# Altium schematic sheet CAN v1.SchDoc
size 297 x 209 mm
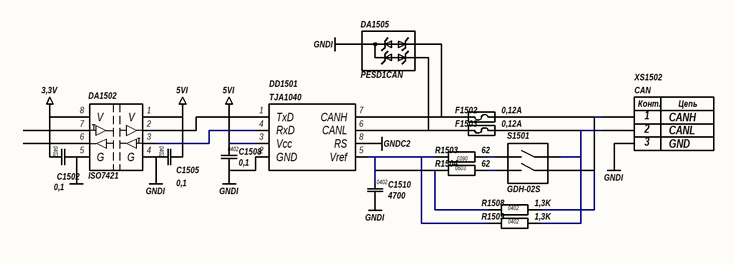
[diagram p0: CAN v1.SchDoc]

## Parts
C1502  0,1  [CAP0402]
C1505  0,1  [CAP0402]
C1508  0,1  [CAP0402]
C1510  4700  [CAP0402]
DA1502  ISO7421  [SO8]
DA1505  PESD1CAN  [SOT-23]
DD1501  TJA1040  [SO8]
F1502  0,12A  [MF-NSMF]
F1503  0,12A  [MF-NSMF]
R1503  62  [RES0603]
R1504  62  [RES0603]
R1508  1,3K  [RES0402]
R1509  1,3K  [RES0402]
S1501  GDH-02S  [GDH02S]
XS1502  CAN  [MW-3M]

## Nets
3,3V: C1502.1 DA1502.8(V)
5VI: C1505.2 C1508.1 DA1502.1(V) DD1501.3(Vcc)
GND: C1502.2 DA1502.5(G)
GNDC2: DD1501.8(RS)
GNDI: C1505.1 C1508.2 C1510.2 DA1502.4(G) DA1505.3(K3) DD1501.2(GND) XS1502.3(GND)
NetC1510_1: C1510.1 DD1501.5(Vref) R1503.2 R1504.1 R1508.1 R1509.1
NetDA1502_2: DA1502.2 DD1501.1(TxD)
NetDA1502_3: DA1502.3 DD1501.4(RxD)
NetDA1505_1: DA1505.1(K1) DD1501.7(CANH) F1502.1
NetDA1505_2: DA1505.2(K2) DD1501.6(CANL) F1503.1
NetF1502_2: F1502.2 R1508.2 S1501.2(2-3) XS1502.1(CANH)
NetF1503_2: F1503.2 R1509.2 S1501.1(1-4) XS1502.2(CANL)
NetR1503_1: R1503.1 S1501.4(4-1)
NetR1504_2: R1504.2 S1501.3(3-2)

Not connected (* = marked no-connect by the designer): DA1502 6 7

## Notes on the sheet
- (in symbol Разъем3_1) Конт.; Цепь

## Library data of the parts
C1502 = CAP_0402: Конденсатор чип; Напряжение: 16V; Тип корпуса: 0402; Тип монтажа: Поверхностный; Номинал: 0,1; Тип компонента: Конденсатор чип; Value: 0,1
C1505 C1508 C1510 = CAP_0402: Конденсатор чип; Тип корпуса: 0402; Тип монтажа: Поверхностный; Тип компонента: Конденсатор чип
  C1505 C1508: Value: 0,1; Номинал: 0,1
  C1510: Номинал: 4700; Value: 4700
DA1502 = ISO7421: Цифровой изолятор 1 вх 1 вых; Тип монтажа: Поверхностный; Производитель: Texas Instruments; Наименование: ISO7421; Тип компонента: Цифровой изолятор 1 вх 1 вых; Тип корпуса: SO8
DA1505 = PESD1CAN: ESD-CAN защита; Тип корпуса: SOT23; Тип монтажа: Поверхностный; Производитель: Philips Semiconductors; Наименование: PESD1CAN; Тип компонента: ESD-CAN защита
DD1501 = TJA1040: Драйвер CAN; Тип монтажа: Поверхностный; Производитель: NXP; Value: *; Наименование: TJA1040; Тип корпуса: SO8; Тип компонента: Драйвер CAN
F1502 F1503 = MF-NSMF: Предохранитель самовосстанавливающийся; Тип монтажа: Поверхностный; Производитель: Bourns; Value: 0,12A; Наименование: MF-NSMF; Номинал: 0,12A; Тип компонента: Предохранитель самовосстанавливающийся; Тип корпуса: MF-NSMF
R1503 R1504 = RES_0603: Резистор чип; Тип корпуса: 0603; Тип монтажа: Поверхностный; Характеристики: 0.1Вт 50В; Номинал: 62; Тип компонента: Резистор чип; Value: 62
R1508 R1509 = RES_0402: Резистор чип; Тип корпуса: 0402; Тип монтажа: Поверхностный; Характеристики: 0.062Вт 50В; Номинал: 1,3K; Тип компонента: Резистор чип; Value: 1,3K
S1501 = GDH02S: DIP-переключатель; Температурный разброс: -30...+85°C; Тип корпуса: SMT; Тип монтажа: Поверхностный; Характеристики: 24V, 25mA; Наименование: GDH-02S; Тип компонента: DIP-переключатель
XS1502 = Разъем3_1: Разъем